# EAGLE design asol_v1 (EAGLE 7.3.0)
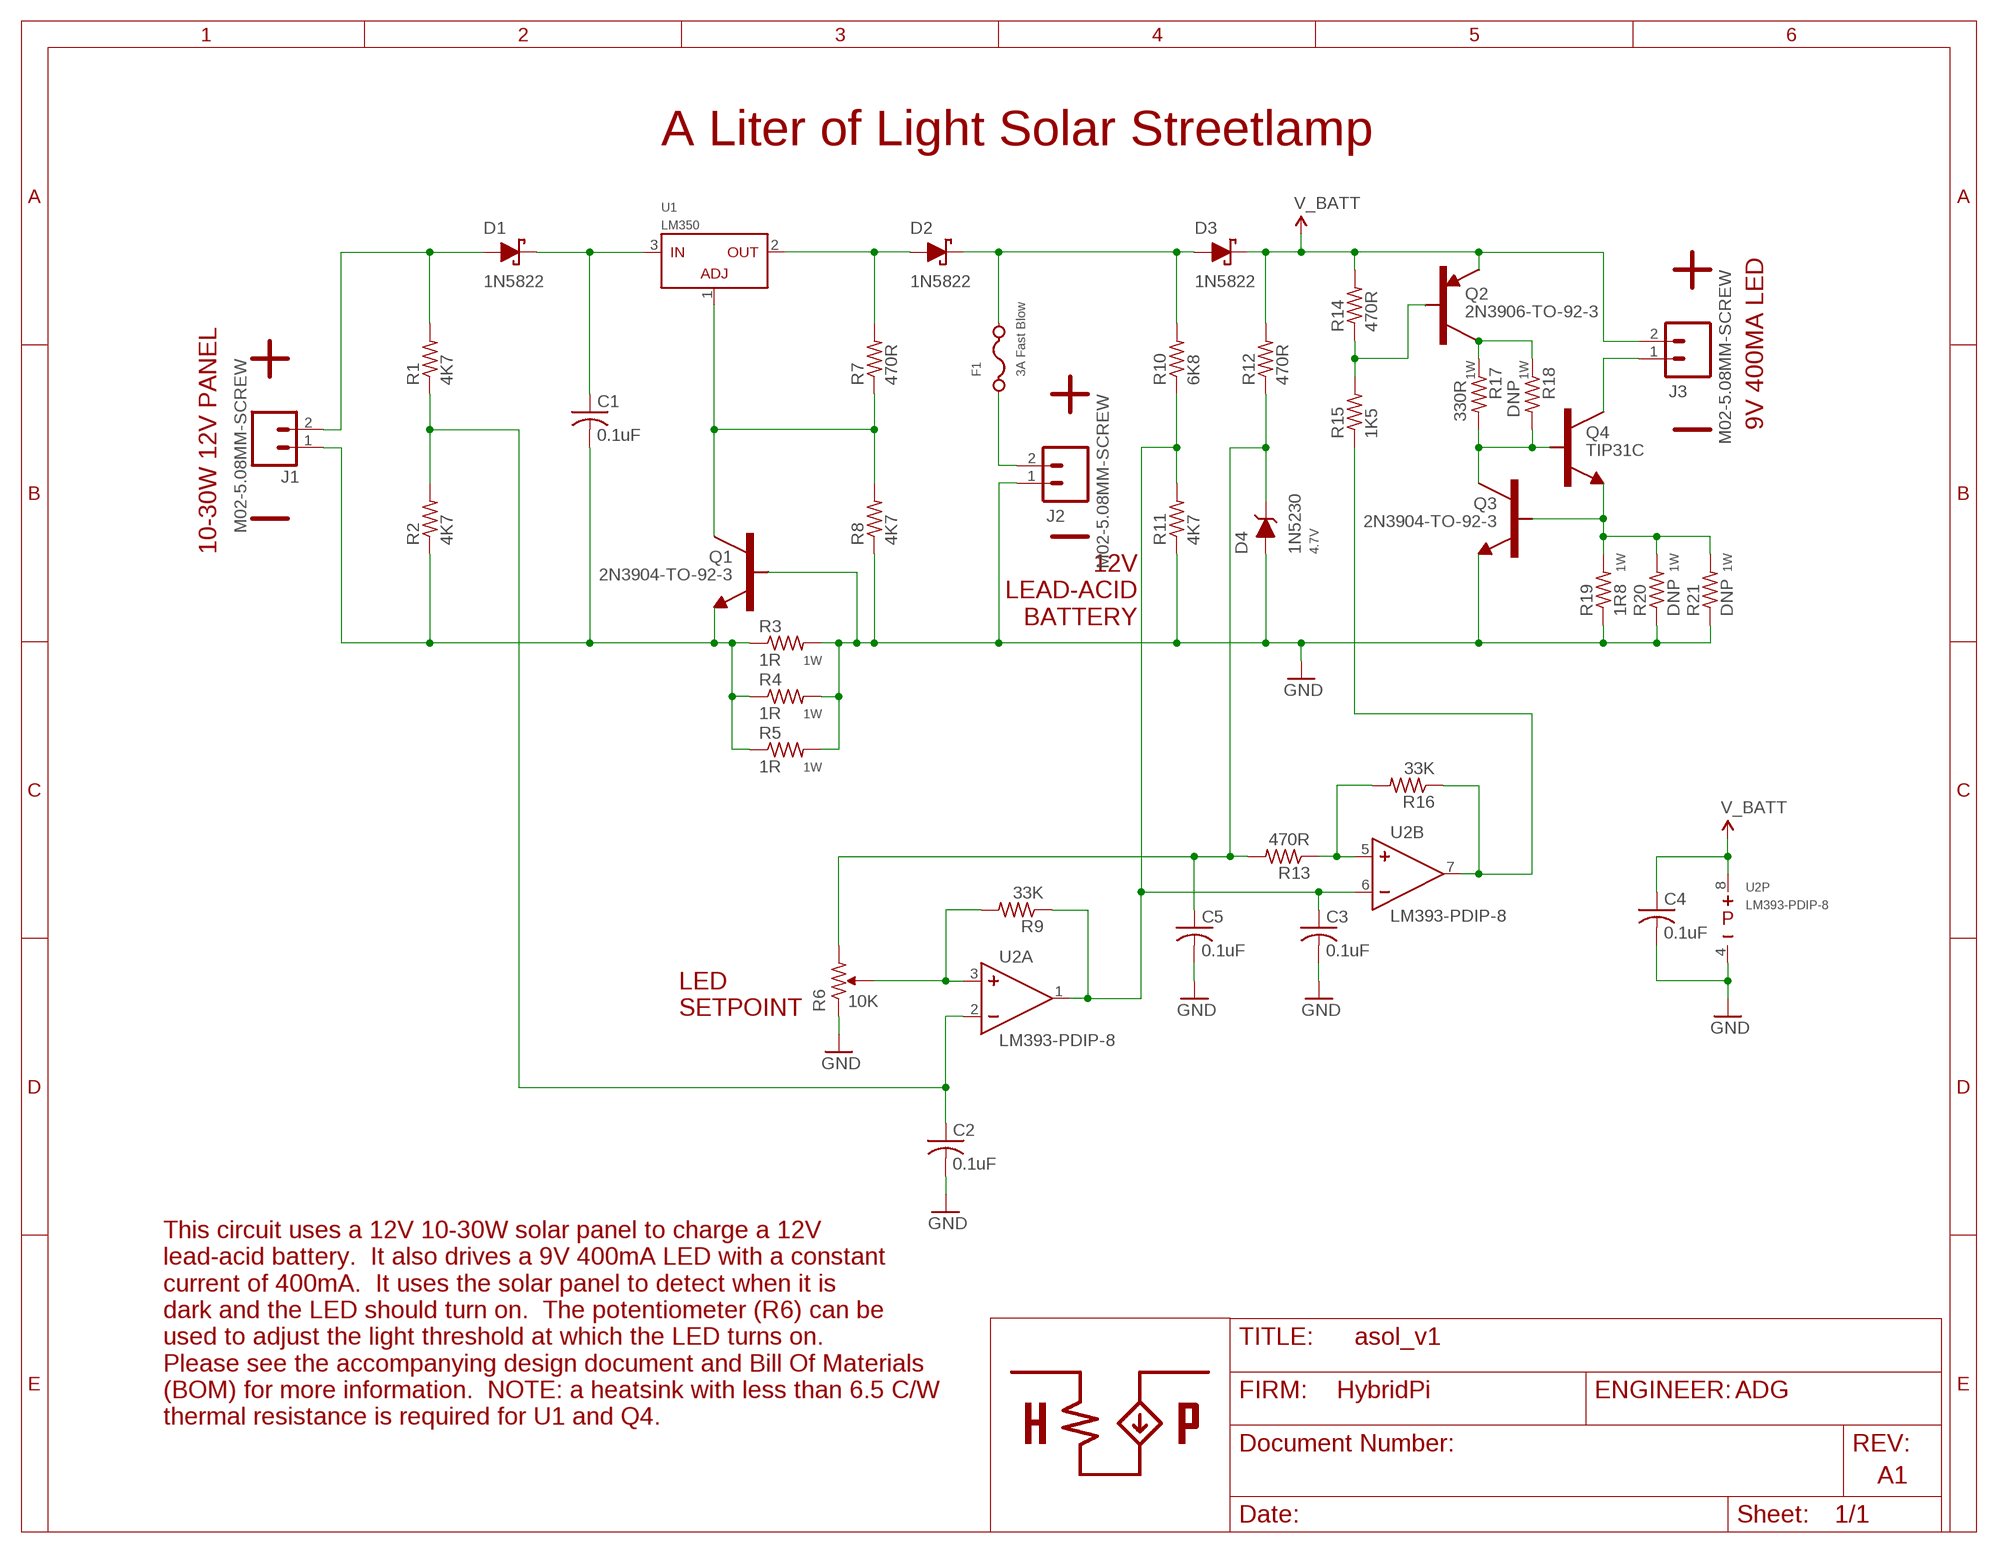
[diagram p0: schematic, sheet 1]

## Parts
C1  0.1uF  C-US025-025X050  [C025-025X050]
C2  0.1uF  C-US025-025X050  [C025-025X050]
C3  0.1uF  C-US025-025X050  [C025-025X050]
C4  0.1uF  C-US025-025X050  [C025-025X050]
C5  0.1uF  C-US025-025X050  [C025-025X050]
D1  1N5822  DIODE-SCHOTTKY-DO-201AD  [DO-201AD]
D2  1N5822  DIODE-SCHOTTKY-DO-201AD  [DO-201AD]
D3  1N5822  DIODE-SCHOTTKY-DO-201AD  [DO-201AD]
D4  1N5230  DIODE-ZENER-DO-35  [DO-35]
F1  3A Fast Blow  FUSE-CARTRIDGE-5X20MM  [FUSE-5X20MM]
J1  M02-5.08MM-SCREW  [SCREW-TERMINAL-5.08MM-1X2]
J2  M02-5.08MM-SCREW  [SCREW-TERMINAL-5.08MM-1X2]
J3  M02-5.08MM-SCREW  [SCREW-TERMINAL-5.08MM-1X2]
Q1  2N3904-TO-92-3  [TO-92-3]
Q2  2N3906-TO-92-3  [TO-92-3]
Q3  2N3904-TO-92-3  [TO-92-3]
Q4  TIP31C  [TO-220-3]
R1  4K7  R-US_0207/12  [0207/12]
R2  4K7  R-US_0207/12  [0207/12]
R3  1R  R-US_0309/12  [0309/12]
R4  1R  R-US_0309/12  [0309/12]
R5  1R  R-US_0309/12  [0309/12]
R6  10K  POT-PTH-5X10MM  [POT-PTH-5X10MM]
R7  470R  R-US_0207/12  [0207/12]
R8  4K7  R-US_0207/12  [0207/12]
R9  33K  R-US_0207/12  [0207/12]
R10  6K8  R-US_0207/12  [0207/12]
R11  4K7  R-US_0207/12  [0207/12]
R12  470R  R-US_0207/12  [0207/12]
R13  470R  R-US_0207/12  [0207/12]
R14  470R  R-US_0207/12  [0207/12]
R15  1K5  R-US_0207/12  [0207/12]
R16  33K  R-US_0207/12  [0207/12]
R17  330R  R-US_0309/12  [0309/12]
R18  DNP  R-US_0309/12  [0309/12]
R19  1R8  R-US_0309/12  [0309/12]
R20  DNP  R-US_0309/12  [0309/12]
R21  DNP  R-US_0309/12  [0309/12]
U1  LM350  [TO-220-3]
U2  LM393-PDIP-8  [PDIP-8]

## Nets
GND: C2.2 C3.2 C4.2 C5.2 D4.P$2(A) J2.1 Q1.2(B) Q3.1(E) R3.2 R4.2 R5.2 R6.1 R8.1 R11.1 R19.1 R20.1 R21.1 U2.4(P:NEG)
N$1: R6.2 R9.2 U2.3(A:IN+)
N$2: J3.1 Q4.2(C)
N$3: Q3.2(B) Q4.3(E) R19.2 R20.2 R21.2
N$4: D2.P$1(C) D3.P$2(A) F1.3 F1.4 R10.2
N$5: Q3.3(C) Q4.1(B) R17.2 R18.2
N$6: Q2.3(C) R17.1 R18.1
N$7: Q2.2(B) R14.1 R15.2
N$9: R15.1 R16.1 U2.7(B:OUT)
N$10: F1.1 F1.2 J2.2
N$11: D2.P$2(A) R7.2 U1.2(OUT)
N$12: Q1.3(C) R7.1 R8.2 U1.1(ADJ)
N$13: C1.2 J1.1 Q1.1(E) R2.1 R3.1 R4.1 R5.1
N$14: D1.P$2(A) J1.2 R1.2
N$15: C1.1 D1.P$1(C) U1.3(IN)
N$16: R13.1 R16.2 U2.5(B:IN+)
REF: C5.1 D4.P$1(C) R6.3 R12.1 R13.2
V_BATT: C4.1 D3.P$1(C) J3.2 Q2.1(E) R12.2 R14.2 U2.8(P:POS)
VMEAS: C3.1 R9.1 R10.1 R11.2 U2.1(A:OUT) U2.6(B:IN-)
VPANEL: C2.1 R1.1 R2.2 U2.2(A:IN-)

## Notes on the sheet
- A Liter of Light Solar Streetlamp
- 9V 400MA LED
- 10-30W 12V PANEL
- 12V
  LEAD-ACID
  BATTERY
- LED
  SETPOINT
- ADG
- This circuit uses a 12V 10-30W solar panel to charge a 12V
  lead-acid battery.  It also drives a 9V 400mA LED with a constant
  current of 400mA.  It uses the solar panel to detect when it is
  dark and the LED should turn on.  The potentiometer (R6) can be
  used to adjust the light threshold at which the LED turns on. 
  Please see the accompanying design document and Bill Of Materials
  (BOM) for more information.  NOTE: a heatsink with less than 6.5 C/W
  thermal resistance is required for U1 and Q4.
- A1

## Library data of the parts
C1-C5 = hybridpi-rcl:C-US: CAPACITOR, American symbol; VENDOR: DIGIKEY; VENDOR_PN: 478-5741-ND
D1-D3 = hybridpi:DIODE-SCHOTTKY: Schottky Diode SMA/B Package Example Datasheet: B1X0(B) <http://www.diodes.com/datasheets/ds13002.pdf>; VENDOR: DIGIKEY; VENDOR_PN: 497-11370-1-ND
D4 = hybridpi:DIODE-ZENER: Zener Diodes; VENDOR: DIGIKEY; VENDOR_PN: 1N5230BFSCT-ND; VOLTAGE: 4.7V
F1 = hybridpi:FUSE-CARTRIDGE: 5x20mm Cartridge Fuse Representative Datasheet: FC-203 <http://belfuse.com/pdfs/fuseclips.pdf>; VENDOR: DIGIKEY; VENDOR_PN: 507-1703-ND
J1-J3 = hybridpi-connector:M02: Standard 2-pin header.; VENDOR: DIGIKEY; VENDOR_PN: ED2609-ND
Q1 Q3 = hybridpi:2N3904: 40V 200mA NPN Transistor Representative Datasheet: 2N3904 <https://www.fairchildsemi.com/datasheets/MM/MMBT3904.pdf>; VENDOR: DIGIKEY; VENDOR_PN: 2N3904FS-ND
Q2 = hybridpi:2N3906: 40V 200mA PNP Transistor Representative Datasheet: 2N3906 <https://www.fairchildsemi.com/datasheets/MM/MMBT3904.pdf>; VENDOR: DIGIKEY; VENDOR_PN: 2N3906TFCT-ND
Q4 = hybridpi:TIP31C: 3A 100V NPN Transistor Datasheet: TIP31C <http://www.st.com/web/en/resource/technical/document/datasheet/CD00104632.pdf>; VENDOR: DIGIKEY; VENDOR_PN: 497-2602-5-ND
R1 R2 R8 R11 = hybridpi-rcl:R-US_: RESISTOR, American symbol; VENDOR: DIGIKEY; VENDOR_PN: CF14JT4K70CT-ND
R3-R5 = hybridpi-rcl:R-US_: RESISTOR, American symbol; POWER: 1W; VENDOR: DIGIKEY; VENDOR_PN: 1.0WCT-ND
R6 = hybridpi:POT; VENDOR: DIGIKEY; VENDOR_PN: 3319P-103-ND
R7 R12-R14 = hybridpi-rcl:R-US_: RESISTOR, American symbol; VENDOR: DIGIKEY; VENDOR_PN: CF14JT470RCT-ND
R9 R16 = hybridpi-rcl:R-US_: RESISTOR, American symbol; VENDOR: DIGIKEY; VENDOR_PN: CF14JT33K0CT-ND
R10 = hybridpi-rcl:R-US_: RESISTOR, American symbol; VENDOR: DIGIKEY; VENDOR_PN: CF14JT6K80CT-ND
R15 = hybridpi-rcl:R-US_: RESISTOR, American symbol; VENDOR: DIGIKEY; VENDOR_PN: CF14JT1K50CT-ND
R17 R18 = hybridpi-rcl:R-US_: RESISTOR, American symbol; POWER: 1W; VENDOR: DIGIKEY; VENDOR_PN: 330ZCT-ND
R19-R21 = hybridpi-rcl:R-US_: RESISTOR, American symbol; POWER: 1W; VENDOR: DIGIKEY; VENDOR_PN: 1.8W-1-ND
U1 = hybridpi:LM350: 35V 3A Linear Regulator Datasheet: LM350 <https://www.fairchildsemi.com/datasheets/LM/LM350.pdf>; VENDOR: DIGIKEY; VENDOR_PN: LM350TFS-ND
U2 = hybridpi:LM393: Dual 36V Comparator - Open Drain Datasheet: LM393 <http://www.ti.com/lit/ds/symlink/lm193-n.pdf>; VENDOR: DIGIKEY; VENDOR_PN: 296-1398-5-ND

## Board
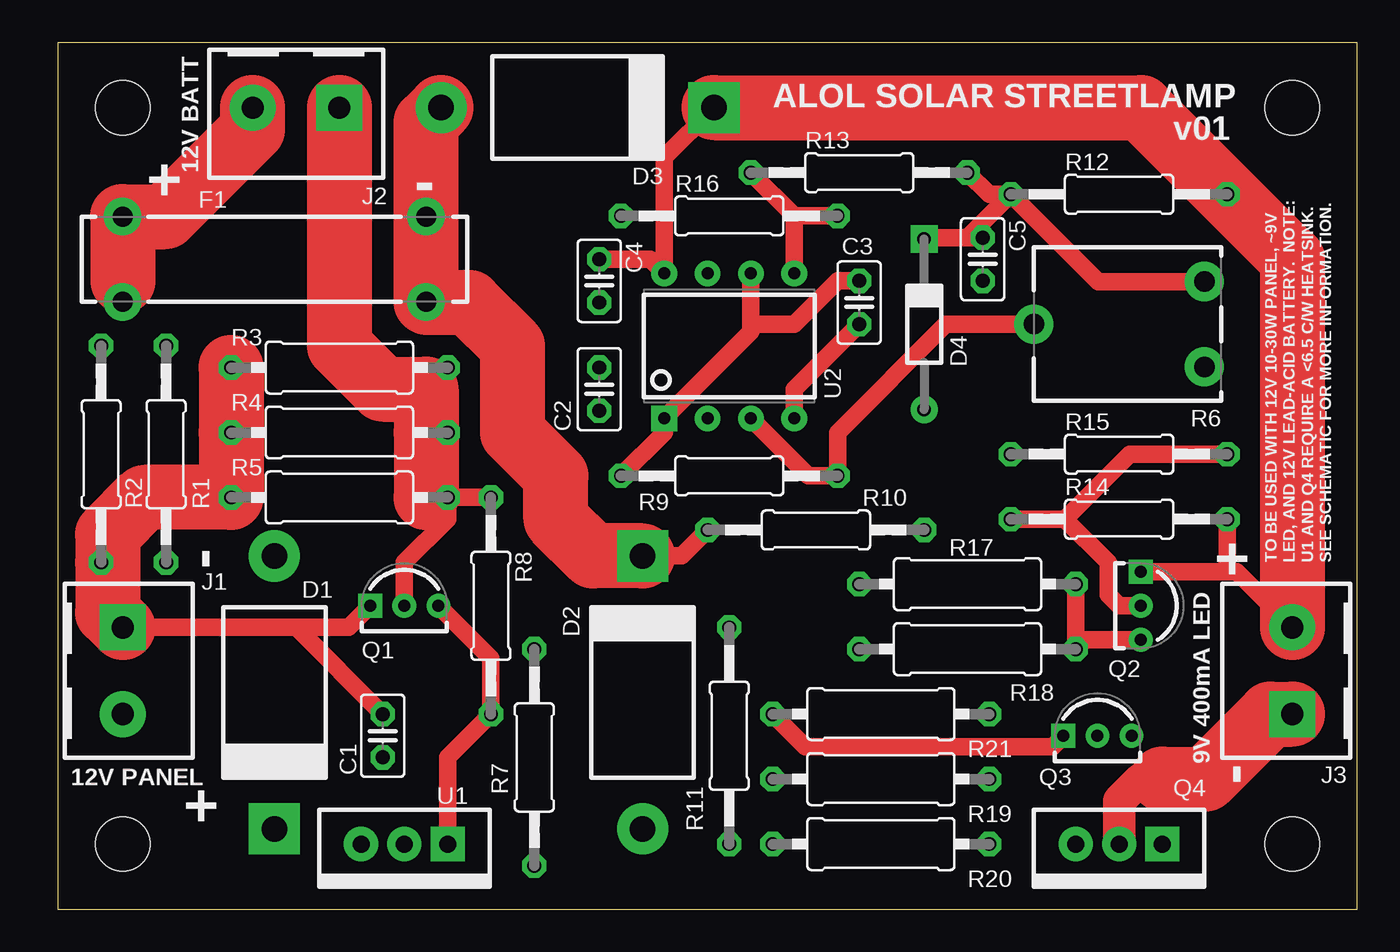
[diagram p1: board, top side]
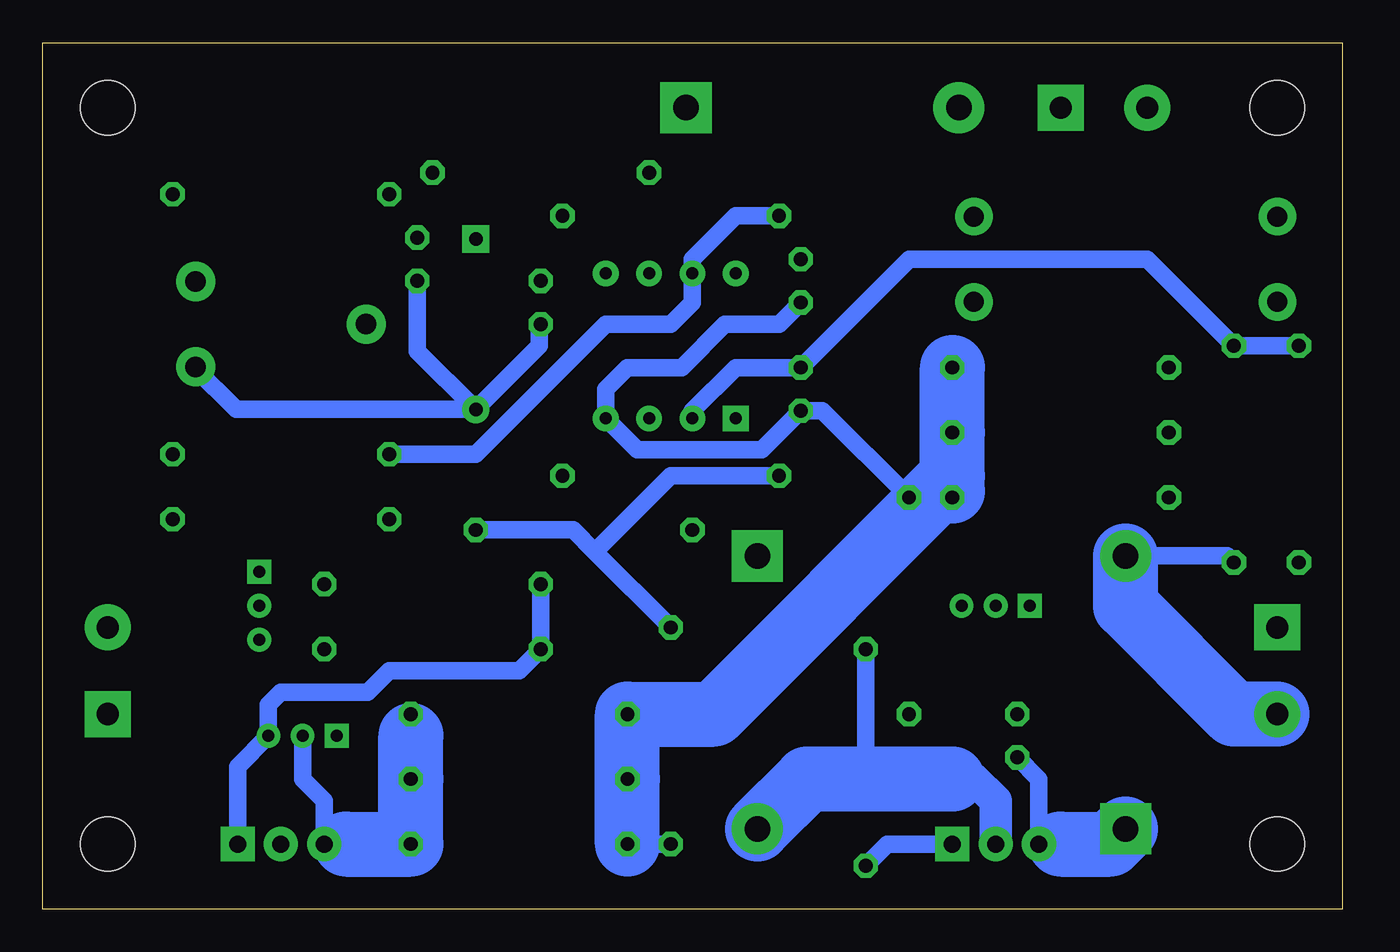
[diagram p2: board, bottom side, seen from below]

Size 76.2 x 50.8 mm. Coordinates in mm from the lower left corner, seen from the top.
Outline: 0,0 76.2,0 76.2,50.8 0,50.8 0,0
Copper layers (1*16): Top 0.035mm / dielectric 1.5mm / Bottom 0.035mm
Design rules "SparkFun *": minimum track width 20mil, minimum drill 20mil, track to track 20mil, track to pad 20mil, pad to pad 20mil, via to via 20mil, smd to smd 20mil, copper to edge 20mil, drill to drill 20mil, minimum pad ring 12mil, minimum via ring 12mil, stop-mask expansion 4mil, vias tented up to drill 20mil, thermal gap 10mil
Holes 3.17 mm at 3.81,3.81 72.39,3.81 3.81,46.99 72.39,46.99

### Footprints (pad centres in the part's own frame; a part is rotated, then mirrored left to right if it is on the bottom)
C025-025X050 = drill 0.813 octagon: 1 -1.27,0; 2 1.27,0
DO-201AD = drill 1.5 pad 3 square: P$1 -8,0 | drill 1.5 pad 3: P$2 8,0
DO-35 = drill 0.8 pad 1.6 square: P$1 -5,0 | drill 0.8 pad 1.6: P$2 5,0
FUSE-5X20MM = drill 1.17 pad 2.2: 1 -8.9,2.5; 2 -8.9,-2.5; 3 8.9,2.5; 4 8.9,-2.5
SCREW-TERMINAL-5.08MM-1X2 = drill 1.3 pad 2.7 square: 1 -2.54,0 | drill 1.3 pad 2.7: 2 2.54,0
TO-92-3 = drill 0.7 pad 1.4 square: 1 -2,0 | drill 0.7 pad 1.4: 2 0,0; 3 2,0
TO-220-3 = drill 1 pad 2 square: 1 -2.54,0 | drill 1 pad 2: 2 0,0; 3 2.54,0
0207/12 = drill 0.813 octagon: 1 -6.35,0; 2 6.35,0
0309/12 = drill 0.813 octagon: 1 -6.35,0; 2 6.35,0
POT-PTH-5X10MM = drill 1.2 pad 2.3: 1 -2.5,-5; 2 0,5; 3 2.5,-5
PDIP-8 = drill 0.7 pad 1.5 square: 1 3.81,4.25 | drill 0.7 pad 1.5: 2 1.27,4.25; 3 -1.27,4.25; 4 -3.81,4.25; 5 -3.81,-4.25; 6 -1.27,-4.25; 7 1.27,-4.25; 8 3.81,-4.25

### Placement (x,y rotation side)
C1  19.05,10.16 90 top
C2  31.75,30.48 270 top
C3  46.99,35.56 270 top
C4  31.75,36.83 270 top
C5  54.23,38.1 270 top
D1  12.7,12.7 90 top
D2  34.29,12.7 270 top
D3  30.48,46.99 180 top
D4  50.8,34.29 270 top
F1  12.7,38.1 0 top
J1  3.81,13.97 270 top
J2  13.97,46.99 180 top
J3  72.39,13.97 90 top
Q1  20.32,17.78 0 top
Q2  63.5,17.78 270 top
Q3  60.96,10.16 0 top
Q4  62.23,3.81 180 top
R1  6.35,26.67 270 top
R2  2.54,26.67 90 top
R3  16.51,31.75 0 top
R4  16.51,27.94 0 top
R5  16.51,24.13 0 top
R6  62.23,34.29 90 top
R7  27.94,8.89 90 top
R8  25.4,17.78 270 top
R9  39.37,25.4 0 top
R10  44.45,22.23 180 top
R11  39.37,10.16 90 top
R12  62.23,41.91 0 top
R13  46.99,43.18 0 top
R14  62.23,22.86 0 top
R15  62.23,26.67 0 top
R16  39.37,40.64 0 top
R17  53.34,19.05 180 top
R18  53.34,15.24 180 top
R19  48.26,7.62 0 top
R20  48.26,3.81 0 top
R21  48.26,11.43 0 top
U1  20.32,3.81 180 top
U2  39.37,33.02 180 top

### Tracks (layer width: path | path; a pad name or v marks a point on that pad's centre or on a via)
GND
  Top 1.016: Q1.2 20.32,20.32 22.86,22.86 R5.2 | Q3.1 58.33,9.53 43.81,9.53 R21.1 | 21.59,24.13 R5.2 | R4.2 21.59,27.94 | R3.2 21.59,30.48 | R8.1 R5.2 | 47.07,34.29 C3.2 43.18,30.48 U2.4
  Top 3.81: J2.1 16.51,33.02 19.05,30.48 21.59,30.48 21.59,27.94 21.59,24.13
  Bottom 1.016: R11.1 R20.1 | R8.1 30.48,29.21 C2.2 34.04,26.92 41.33,26.92 U2.4 43.18,30.48 41.91,31.75 38.73,31.75 36.2,34.29 33.02,34.29 C4.2 | R6.1 67.27,31.75 67.31,31.75 64.85,29.29 D4.P$2 | C3.2 47.07,34.29 47.07,33.02 D4.P$2 | C5.2 54.23,32.72 D4.P$2
  Bottom 3.81: R20.1 R19.1 R21.1 36.83,11.43 22.86,25.4 R4.2 | 22.86,24.51 R4.2 | R4.2 R3.2
N$1
  Top 1.016: U2.3 44.01,25.4 R9.2 45.72,27.94 52.07,34.29 R6.2
N$2
  Top 1.905: Q4.2 62.23,6.35 63.5,7.62 64.77,7.62
  Top 3.81: 64.77,7.62 67.31,7.62 71.12,11.43 J3.1
N$3
  Bottom 1.016: Q3.2 60.96,7.62 59.69,6.35 Q4.3 | 54.61,10.16 R21.2 R19.2
  Bottom 1.905: 58.42,3.81 Q4.3
  Bottom 3.81: 58.42,3.81 R20.2 R19.2 54.61,10.16
N$4
  Top 1.016: R10.2 36.58,20.7 D2.P$1
  Top 3.81: D3.P$2 21.6,46.11 F1.3 F1.4 21.64,35.56 24.13,35.56 26.67,33.02 26.67,27.94 29.21,25.4 29.21,22.86 31.37,20.7 D2.P$1
N$5
  Bottom 1.016: Q4.1 64.77,8.35 Q3.3 62.96,11.97 62.23,12.7 57.15,12.7 55.88,13.97 48.26,13.97 R18.2 R17.2
N$6
  Top 1.016: Q2.3 60.23,15.78 R18.1 R17.1
N$7
  Top 1.016: R14.1 59.05,22.86 | 59.05,22.86 61.59,20.32 61.59,18.41 62.23,17.78 Q2.2 | R15.2 62.87,26.67 59.05,22.86
N$9
  Bottom 1.016: R15.1 50.8,26.67 43.18,34.29 39.37,34.29 38.1,35.56 U2.7 38.1,38.1 35.56,40.64 R16.1
N$10
  Top 1.905: 3.81,36.83 3.8,36.82 F1.2
  Top 3.81: J2.2 11.43,45.72 6.31,40.6 F1.1 3.81,36.83
N$11
  Bottom 1.016: R7.2 27.94,7.62
  Bottom 1.905: U1.2 20.32,6.35 21.59,7.62 22.86,7.62
  Bottom 3.81: 22.86,7.62 27.94,7.62 31.37,7.62 D2.P$2
N$12
  Top 1.016: U1.1 22.86,8.89 R8.2 25.4,14.7 Q1.3
  Bottom 1.016: R7.1 26.67,3.81 U1.1
N$13
  Top 1.016: C1.2 13.97,16.51 | 13.97,16.51 J1.1 | Q1.1 17.05,16.51 13.97,16.51 | R2.1 2.92,20.32
  Top 3.81: R3.1 R4.1 R5.1 5.08,24.13 2.92,21.97 2.92,20.32 2.92,17.4 J1.1
N$14
  Bottom 1.016: R1.2 6.73,20.7 D1.P$2
  Bottom 3.81: J1.2 6.35,11.43 12.7,17.78 D1.P$2
N$15
  Bottom 1.016: C1.1 17.78,7.62 U1.3
  Bottom 1.905: U1.3 16.51,3.81
  Bottom 3.81: 16.51,3.81 13.59,3.81 D1.P$1
N$16
  Top 1.016: R13.1 43.18,40.64 | 43.18,40.64 R16.2 | U2.5 43.18,40.64
REF
  Top 1.016: R13.2 54.61,41.91 R12.1 | R12.1 61,36.79 R6.3 | D4.P$1 50.88,39.37 52.07,39.37 53.34,39.37 | 53.34,39.37 C5.1 | 53.34,39.37 R12.1
V_BATT
  Top 1.016: Q2.1 68.58,19.78 | 68.58,19.78 69.12,19.78 J3.2 | R14.2 68.58,19.78 | D3.P$1 35.56,44.07 U2.8 34.73,38.1 C4.1
  Top 3.81: D3.P$1 63.5,46.99 R12.2 72.39,38.1 J3.2
VMEAS
  Top 1.016: R9.1 35.56,27.94 U2.1 40.64,33.85 40.64,34.29 | 40.64,34.29 U2.6 | C3.1 45.72,36.83 43.18,34.29 40.64,34.29
  Bottom 1.016: R11.2 43.81,20.95 | 43.81,20.95 45.09,22.23 R10.1 | R9.1 39.37,25.4 43.81,20.95
VPANEL
  Bottom 1.016: U2.2 38.1,29.21 35.56,31.75 C2.1 25.4,38.1 11.43,38.1 R1.1 R2.2

### Text on the board
tPlace: ALOL SOLAR STREETLAMP | v01 | - | 12V BATT | + | - | TO BE USED WITH 12V 10-30W PANEL, ~9V / LED, AND 12V LEAD-ACID BATTERY. NOTE: / U1 AND Q4 REQUIRE A <6.5 C/W HEATSINK. / SEE SCHEMATIC FOR MORE INFORMATION. | + | - | 9V 400mA LED | 12V PANEL | +